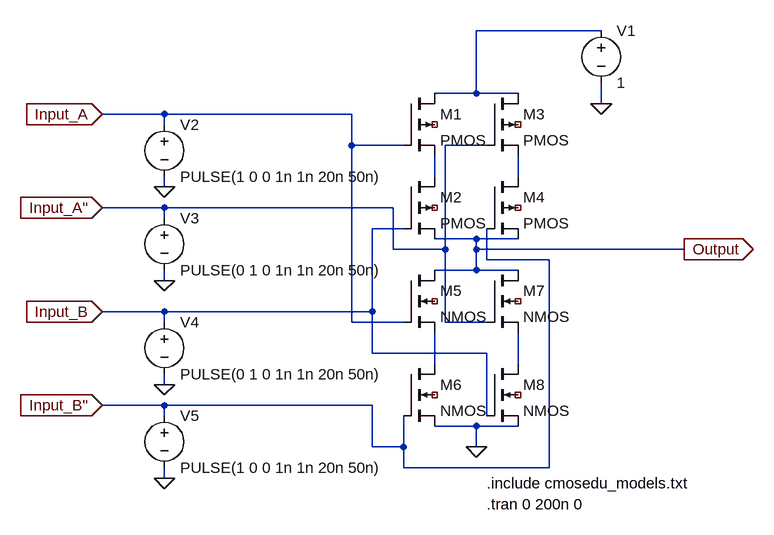
[diagram p0: schematic EXP_6 (XNOR).asc]
EXP_6 (XNOR).asc, the LTspice schematic file:
Version 4
SHEET 1 880 680
WIRE 432 -80 240 -80
WIRE 240 16 240 -80
WIRE 240 16 176 16
WIRE 304 16 240 16
WIRE 432 32 432 0
WIRE -240 48 -336 48
WIRE 48 48 -240 48
WIRE -240 64 -240 48
WIRE 48 96 48 48
WIRE 128 96 48 96
WIRE 256 96 192 96
WIRE 176 144 176 112
WIRE 304 144 304 112
WIRE -240 160 -240 144
WIRE -240 192 -336 192
WIRE 112 192 -240 192
WIRE -240 208 -240 192
WIRE 128 224 80 224
WIRE 240 240 176 240
WIRE 304 240 240 240
WIRE 112 256 112 192
WIRE 192 256 192 96
WIRE 192 256 112 256
WIRE 240 256 240 240
WIRE 560 256 240 256
WIRE 256 272 256 224
WIRE 352 272 256 272
WIRE 240 288 240 256
WIRE 240 288 176 288
WIRE 304 288 240 288
WIRE -240 304 -240 288
WIRE -240 352 -336 352
WIRE 80 352 80 224
WIRE 80 352 -240 352
WIRE -240 368 -240 352
WIRE 48 368 48 96
WIRE 128 368 48 368
WIRE 192 368 192 256
WIRE 256 368 192 368
WIRE 80 416 80 352
WIRE 256 416 80 416
WIRE 176 432 176 384
WIRE 304 432 304 384
WIRE -240 464 -240 448
WIRE -240 496 -336 496
WIRE 80 496 -240 496
WIRE -240 512 -240 496
WIRE 256 512 256 416
WIRE 240 528 176 528
WIRE 304 528 240 528
WIRE 80 560 80 496
WIRE 128 560 128 512
WIRE 128 560 80 560
WIRE 240 560 240 528
WIRE 128 592 128 560
WIRE 352 592 352 272
WIRE 352 592 128 592
WIRE -240 608 -240 592
FLAG -336 48 Input_A
IOPIN -336 48 In
FLAG -336 192 Input_A"
IOPIN -336 192 In
FLAG -336 352 Input_B
IOPIN -336 352 In
FLAG -336 496 Input_B"
IOPIN -336 496 In
FLAG 560 256 Output
IOPIN 560 256 Out
FLAG -240 160 0
FLAG -240 304 0
FLAG -240 464 0
FLAG -240 608 0
FLAG 240 560 0
FLAG 432 32 0
SYMBOL pmos4 128 16 R0
SYMATTR InstName M1
SYMBOL pmos4 128 144 R0
SYMATTR InstName M2
SYMBOL pmos4 256 16 R0
SYMATTR InstName M3
SYMBOL pmos4 256 144 R0
SYMATTR InstName M4
SYMBOL nmos4 128 288 R0
SYMATTR InstName M5
SYMBOL nmos4 128 432 R0
SYMATTR InstName M6
SYMBOL nmos4 256 288 R0
SYMATTR InstName M7
SYMBOL nmos4 256 432 R0
SYMATTR InstName M8
SYMBOL voltage 432 -96 R0
SYMATTR InstName V1
SYMATTR Value 1
SYMBOL voltage -240 48 R0
SYMATTR InstName V2
SYMATTR Value PULSE(1 0 0 1n 1n 20n 50n)
SYMBOL voltage -240 192 R0
SYMATTR InstName V3
SYMATTR Value PULSE(0 1 0 1n 1n 20n 50n)
SYMBOL voltage -240 352 R0
SYMATTR InstName V4
SYMATTR Value PULSE(0 1 0 1n 1n 20n 50n)
SYMBOL voltage -240 496 R0
SYMATTR InstName V5
SYMATTR Value PULSE(1 0 0 1n 1n 20n 50n)
TEXT 256 616 Left 2 !.include cmosedu_models.txt
TEXT 256 648 Left 2 !.tran 0 200n 0

The netlist it stands for:
* EXP_6 (XNOR).asc
M1 N001 Input_A N002 NC_01 PMOS
M2 N002 Input_B Output NC_02 PMOS
M3 N001 Input_A" N003 NC_03 PMOS
M4 N003 Input_B" Output NC_04 PMOS
M5 Output Input_A N004 NC_05 NMOS
M6 N004 Input_B" 0 NC_06 NMOS
M7 Output Input_A" N005 NC_07 NMOS
M8 N005 Input_B 0 NC_08 NMOS
V1 N001 0 1
V2 Input_A 0 PULSE(1 0 0 1n 1n 20n 50n)
V3 Input_A" 0 PULSE(0 1 0 1n 1n 20n 50n)
V4 Input_B 0 PULSE(0 1 0 1n 1n 20n 50n)
V5 Input_B" 0 PULSE(1 0 0 1n 1n 20n 50n)
.model NMOS NMOS
.model PMOS PMOS
.lib standard.mos
.include cmosedu_models.txt
.tran 0 200n 0
.backanno
.end